# Altium schematic sheet Connectors.SchDoc: Gimbal - Connectors
size Letter; DrawnBy: Aidan Gratton; Organization: UW Robotics; Address1: 200 University Avenue; Address2: Waterloo; Address3: Ontario; Address4: Canada N2L 3G6; SheetNumber: 3; SheetTotal: 7
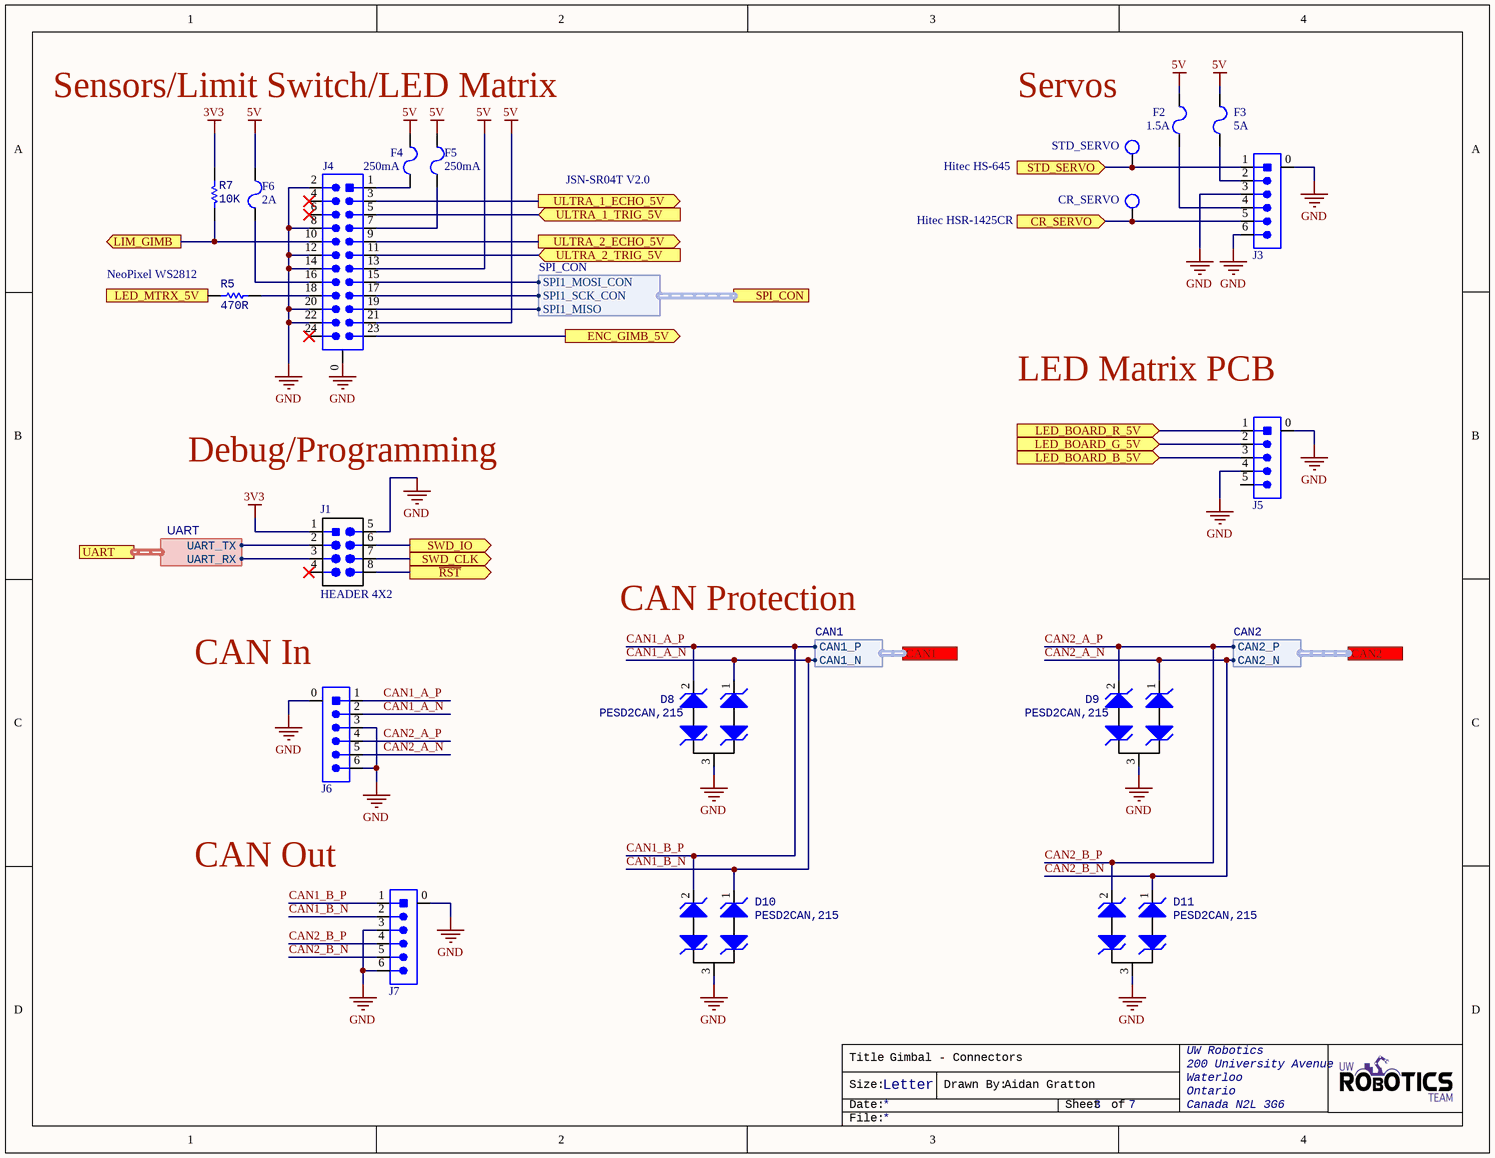
[diagram p0: Connectors.SchDoc]

## Parts
CR_SERVO  TESTPOINT_LOOP  [TESTPOINT_LOOP]  (value not drawn)
D8  Manufacturer Part Number: PESD2CAN,215  [TVS_DIODE_CAN]  (hidden comment: TVS_DIODE_CAN)
D9  Manufacturer Part Number: PESD2CAN,215  [TVS_DIODE_CAN]  (hidden comment: TVS_DIODE_CAN)
D10  Manufacturer Part Number: PESD2CAN,215  [TVS_DIODE_CAN]  (hidden comment: TVS_DIODE_CAN)
D11  Manufacturer Part Number: PESD2CAN,215  [TVS_DIODE_CAN]  (hidden comment: TVS_DIODE_CAN)
F2  Current Rating: 1.5A  [FUSE_1206]  (hidden comment: FUSE_1.5A_1206)
F3  Current Rating: 5A  [FUSE_1206]  (hidden comment: FUSE_5A_1206)
F4  Current Rating: 250mA  [FUSE_1206]  (hidden comment: FUSE_250mA_1206)
F5  Current Rating: 250mA  [FUSE_1206]  (hidden comment: FUSE_250mA_1206)
F6  Current Rating: 2A  [FUSE_1206]  (hidden comment: FUSE_2A_1206)
J1  HEADER 4X2  [HEADER_2X4]
J3  CON_6M_SM_RA  [MOLEX-5024940670]  (value not drawn)
J4  CON_12x2M_SM_RA  [MOLEX-5031482490]  (value not drawn)
J5  CON_5M_SM_RA  [MOLEX-5025850570]  (value not drawn)
J6  CON_6M_SM_RA  [MOLEX-5024940670]  (value not drawn)
J7  CON_6M_SM_RA  [MOLEX-5024940670]  (value not drawn)
R5  value 470R  [RESC0603(1608)_N]  (hidden comment: 470R 1%)
R7  value 10K  [RESC0603(1608)_N]  (hidden comment: RES_10K_0603)
STD_SERVO  TESTPOINT_LOOP  [TESTPOINT_LOOP]  (value not drawn)

## Ports
CAN1 (harness CAN1), CAN2 (harness CAN2), CR_SERVO (in), ENC_GIMB_5V (out), LED_BOARD_B_5V (in), LED_BOARD_G_5V (in), LED_BOARD_R_5V (in), LED_MTRX_5V (in), LIM_GIMB (out), SPI_CON (harness SPI_CON), STD_SERVO (in), SWD_CLK (out), SWD_IO (out), UART (harness UART), ULTRA_1_ECHO_5V (out), ULTRA_1_TRIG_5V (in), ULTRA_2_ECHO_5V (out), ULTRA_2_TRIG_5V (in), ~{RST} (out)

## Harnesses
UART: UART_RX, UART_TX
CAN2: CAN2_P, CAN2_N
CAN1: CAN1_P, CAN1_N
SPI_CON: SPI1_MISO, SPI1_MOSI_CON, SPI1_SCK_CON

## Nets
3V3: J1.1(VCC) R7.2
5V: F2.2 F3.2 F4.1 F5.2 F6.2 J4.13 J4.21
GND: D8.3 D9.3 D10.3 D11.3 J1.5(GND) J3.0 J3.3 J3.6 J4.0 J4.2 J4.8 J4.12 J4.14 J4.20 J4.22 J5.0 J5.4 J6.0 J6.3 J6.6 J7.0 J7.3 J7.6
~{RST}: J1.8 ; port ~{RST}
CAN1_A_N: D8.1 D10.1 J6.2 J7.2 ; port CAN1.CAN1_N  [also labelled CAN1_B_N]
CAN1_A_P: D8.2 D10.2 J6.1 J7.1 ; port CAN1.CAN1_P  [also labelled CAN1_B_P]
CAN2_A_N: D9.1 D11.1 J6.5 J7.5 ; port CAN2.CAN2_N  [also labelled CAN2_B_N]
CAN2_A_P: D9.2 D11.2 J6.4 J7.4 ; port CAN2.CAN2_P  [also labelled CAN2_B_P]
CR_SERVO: CR_SERVO.1 J3.5 ; port CR_SERVO
ENC_GIMB_5V: J4.23 ; port ENC_GIMB_5V
LED_BOARD_B_5V: J5.3 ; port LED_BOARD_B_5V
LED_BOARD_G_5V: J5.2 ; port LED_BOARD_G_5V
LED_BOARD_R_5V: J5.1 ; port LED_BOARD_R_5V
LED_MTRX_5V: R5.1 ; port LED_MTRX_5V
LIM_GIMB: J4.10 R7.1 ; port LIM_GIMB
STD_SERVO: J3.1 STD_SERVO.1 ; port STD_SERVO
SWD_CLK: J1.7 ; port SWD_CLK
SWD_IO: J1.6 ; port SWD_IO
ULTRA_1_ECHO_5V: J4.3 ; port ULTRA_1_ECHO_5V
ULTRA_1_TRIG_5V: J4.5 ; port ULTRA_1_TRIG_5V
ULTRA_2_ECHO_5V: J4.9 ; port ULTRA_2_ECHO_5V
ULTRA_2_TRIG_5V: J4.11 ; port ULTRA_2_TRIG_5V
NetF2_1: F2.1 J3.4
NetF3_1: F3.1 J3.2
NetF4_2: F4.2 J4.1
NetF5_1: F5.1 J4.7
NetF6_1: F6.1 J4.16
NetJ1_2: J1.2 ; port UART.UART_TX
NetJ1_3: J1.3 ; port UART.UART_RX
NetJ4_15: J4.15 ; port SPI_CON.SPI1_MOSI_CON
NetJ4_17: J4.17 ; port SPI_CON.SPI1_SCK_CON
NetJ4_18: J4.18 R5.2
NetJ4_19: J4.19 ; port SPI_CON.SPI1_MISO

Not connected (* = marked no-connect by the designer): J1 4*; J4 4* 6* 24*; J5 5

## Notes on the sheet
- Sensors/Limit Switch/LED Matrix
- Servos
- JSN-SR04T V2.0
- Hitec HSR-1425CR
- Hitec HS-645
- (near R5) NeoPixel WS2812
- (near J5) LED Matrix PCB
- Debug/Programming
- CAN Protection
- (near J6) CAN In
- CAN Out
- Title
- Size:
- Date:
- Letter
- Drawn By:
- Sheet
- of
- File:

## Library data of the parts
CR_SERVO STD_SERVO = TESTPOINT_LOOP: Loop testpoint through-hole pad; Manufacturer: Keystone Electronics; Manufacturer Part Number 1: 5002; Supplier Part Number 1: 36-5002-ND; Supplier 1: Digi-Key
D8-D11 = TVS_DIODE_CAN: TVS DIODE 24V 41V SOT323-3; Manufacturer: Nexperia USA Inc.; Package: SC-70, SOT-323; ComponentLink1Description: Datasheet; ComponentLink1URL: https://assets.nexperia.com/documents/data-sheet/PESD1CAN-U.pdf; Supplier Part Number 1: 1727-3891-1-ND; Supplier 1: Digi-Key
F2 = FUSE_1.5A_1206: FUSE SMD 1.5A 63V; Manufacturer 1: Littelfuse; Manufacturer Part Number 1: 046601.5NR; Fuse Type: Board Mount (Cartridge Style Excluded); DC Cold Resistance: 31mR; Power Dissipation: 157.5mW; Approvals: UL,CSA; Supplier 1: Digi-Key; Stock 1: 8989; Pricing 1: 1=0.84000, 5=0.81200, 10=0.78700, 50=0.66180, 100=0.54930, 250=0.49940, 500=0.42450, 1000=0.37455 (USD); RoHS: Yes; Mount: Surface Mount; Case/Package: 1206; Case Code (Imperial): 1206; Case Code (Metric): 3216; Housing Material: Ceramic; Min Operating Temperature: -55°C; Max Operating Temperature: 90°C; Package Quantity: 5000; Voltage Rating (AC): 63V; Voltage Rating (DC): 63V; Packaging: Tape and Reel; Current: 1.5A; Length: 3.18mm; Height: 0.023inch; Width: 0.06inch; Depth: 1.52mm; ComponentLink1URL: https://datasheet.ciiva.com/7444/littelfuse-fuse-466-7444359.pdf?src-supplier=Digi-Key; ComponentLink1Description: https://datasheet.ciiva.com/7444/littelfuse-fuse-466-7444359.pdf?src-supplier=Digi-Key; ComponentLink2URL: https://datasheet.ciiva.com/7444/littelfuse-fuse-466-7444363.pdf?src-supplier=Digi-Key; ComponentLink2Description: https://datasheet.ciiva.com/7444/littelfuse-fuse-466-7444363.pdf?src-supplier=Digi-Key; ComponentLink3URL: https://datasheet.ciiva.com/7444/littelfuse-fuse-466-7444350.pdf?src-supplier=Digi-Key; ComponentLink3Description: https://datasheet.ciiva.com/7444/littelfuse-fuse-466-7444350.pdf?src-supplier=Digi-Key; Supplier Part Number 1: F1462CT-ND
F3 = FUSE_5A_1206: FUSE SMD 5A 63V; Manufacturer 1: Littelfuse; Manufacturer Part Number 1: 0466005.NRHF; Voltage Rating (AC): 32V; Fuse Type: Board Mount (Cartridge Style Excluded); DC Cold Resistance: 31mR; Power Dissipation: 157.5mW; Approvals: UL,CSA; Supplier 1: Digi-Key; Stock 1: 8989; Pricing 1: 1=0.84000, 5=0.81200, 10=0.78700, 50=0.66180, 100=0.54930, 250=0.49940, 500=0.42450, 1000=0.37455 (USD); RoHS: Yes; Mount: Surface Mount; Case/Package: 1206; Case Code (Imperial): 1206; Case Code (Metric): 3216; Housing Material: Ceramic; Min Operating Temperature: -55°C; Max Operating Temperature: 90°C; Package Quantity: 5000; Voltage Rating (DC): 32V; Packaging: Tape and Reel; Current: 5A; Length: 3.18mm; Height: 0.023inch; Width: 0.06inch; Depth: 1.52mm; ComponentLink1URL: https://datasheet.ciiva.com/7444/littelfuse-fuse-466-7444359.pdf?src-supplier=Digi-Key; ComponentLink1Description: https://datasheet.ciiva.com/7444/littelfuse-fuse-466-7444359.pdf?src-supplier=Digi-Key; ComponentLink2URL: https://datasheet.ciiva.com/7444/littelfuse-fuse-466-7444363.pdf?src-supplier=Digi-Key; ComponentLink2Description: https://datasheet.ciiva.com/7444/littelfuse-fuse-466-7444363.pdf?src-supplier=Digi-Key; ComponentLink3URL: https://datasheet.ciiva.com/7444/littelfuse-fuse-466-7444350.pdf?src-supplier=Digi-Key; ComponentLink3Description: https://datasheet.ciiva.com/7444/littelfuse-fuse-466-7444350.pdf?src-supplier=Digi-Key; Supplier Part Number 1: F6019CT-ND
F4 F5 = FUSE_250mA_1206: FUSE SMD 250mA 125V; Manufacturer 1: Littelfuse; Manufacturer Part Number 1: 0466.250NR; Fuse Type: Board Mount (Cartridge Style Excluded); DC Cold Resistance: 31mR; Power Dissipation: 157.5mW; Approvals: UL,CSA; Supplier 1: Digi-Key; Stock 1: 8989; Pricing 1: 1=0.84000, 5=0.81200, 10=0.78700, 50=0.66180, 100=0.54930, 250=0.49940, 500=0.42450, 1000=0.37455 (USD); RoHS: Yes; Mount: Surface Mount; Case/Package: 1206; Case Code (Imperial): 1206; Case Code (Metric): 3216; Housing Material: Ceramic; Min Operating Temperature: -55°C; Max Operating Temperature: 90°C; Package Quantity: 5000; Voltage Rating (AC): 125V; Voltage Rating (DC): 125V; Packaging: Tape and Reel; Current: 250mA; Length: 3.18mm; Height: 0.023inch; Width: 0.06inch; Depth: 1.52mm; ComponentLink1URL: https://datasheet.ciiva.com/7444/littelfuse-fuse-466-7444359.pdf?src-supplier=Digi-Key; ComponentLink1Description: https://datasheet.ciiva.com/7444/littelfuse-fuse-466-7444359.pdf?src-supplier=Digi-Key; ComponentLink2URL: https://datasheet.ciiva.com/7444/littelfuse-fuse-466-7444363.pdf?src-supplier=Digi-Key; ComponentLink2Description: https://datasheet.ciiva.com/7444/littelfuse-fuse-466-7444363.pdf?src-supplier=Digi-Key; ComponentLink3URL: https://datasheet.ciiva.com/7444/littelfuse-fuse-466-7444350.pdf?src-supplier=Digi-Key; ComponentLink3Description: https://datasheet.ciiva.com/7444/littelfuse-fuse-466-7444350.pdf?src-supplier=Digi-Key; Supplier Part Number 1: F1452CT-ND
F6 = FUSE_2A_1206: FUSE SMD 2A 63V; Manufacturer 1: Littelfuse; Manufacturer Part Number 1: 0466002.NRHF; Fuse Type: Board Mount (Cartridge Style Excluded); DC Cold Resistance: 31mR; Power Dissipation: 157.5mW; Approvals: UL,CSA; Supplier 1: Digi-Key; Stock 1: 8989; Pricing 1: 1=0.84000, 5=0.81200, 10=0.78700, 50=0.66180, 100=0.54930, 250=0.49940, 500=0.42450, 1000=0.37455 (USD); RoHS: Yes; Mount: Surface Mount; Case/Package: 1206; Case Code (Imperial): 1206; Case Code (Metric): 3216; Housing Material: Ceramic; Min Operating Temperature: -55°C; Max Operating Temperature: 90°C; Package Quantity: 5000; Voltage Rating (AC): 63V; Voltage Rating (DC): 63V; Packaging: Tape and Reel; Current: 2A; Length: 3.18mm; Height: 0.023inch; Width: 0.06inch; Depth: 1.52mm; ComponentLink1URL: https://datasheet.ciiva.com/7444/littelfuse-fuse-466-7444359.pdf?src-supplier=Digi-Key; ComponentLink1Description: https://datasheet.ciiva.com/7444/littelfuse-fuse-466-7444359.pdf?src-supplier=Digi-Key; ComponentLink2URL: https://datasheet.ciiva.com/7444/littelfuse-fuse-466-7444363.pdf?src-supplier=Digi-Key; ComponentLink2Description: https://datasheet.ciiva.com/7444/littelfuse-fuse-466-7444363.pdf?src-supplier=Digi-Key; ComponentLink3URL: https://datasheet.ciiva.com/7444/littelfuse-fuse-466-7444350.pdf?src-supplier=Digi-Key; ComponentLink3Description: https://datasheet.ciiva.com/7444/littelfuse-fuse-466-7444350.pdf?src-supplier=Digi-Key; Supplier Part Number 1: F5696CT-ND
J1 = HEADER 4X2: CONN HEADER VERT 8POS 2.54MM; Manufacturer Part Number 1: M20-9980445; Manufacturer 1: Harwin Inc.; Supplier Part Number 1: 952-2122-ND; Supplier 1: Digi-Key; Mount: Through Hole
J3 J6 J7 = CON_6M_SM_RA: CONN HEADER SMD RIGHT ANGLE 2MM PITCH; Manufacturer 1: Molex; Manufacturer Part Number 1: 502494-0670; Insulation Resistance: 1GR; Current Rating: 3A; Voltage Rating: 250V; Connector Type: Receptacle,Forked; Number of Positions: 6; Gender: Receptacle; Glow Wire Compliant: Non-compliant; Supplier 1: Digi-Key; Stock 1: 7093; Pricing 1: 1=0.81000, 10=0.70800, 25=0.66680, 50=0.63880, 100=0.61110, 250=0.55552 (USD); RoHS: Yes; Mount: Surface Mount; Material: Polybutylene; Color: Natural; Housing Material: PBT; Housing Color: Natural; Contact Plating: Tin; Contact Material: Copper Alloy; Min Operating Temperature: -25°C; Max Operating Temperature: 85°C; Package Quantity: 950; Number of Rows: 1; Fastening Type: Latch; Packaging: Tape and Reel; Termination: Solder; Number of Contacts: 6; Orientation: Right Angle; Number of Circuits: 6; Contact Gender: Female; Max Voltage Rating (AC): 250V; Max Voltage Rating (DC): 250V; Length: 16mm; Pitch: 2mm; Depth: 6.85mm; Radiation Hardening: No; REACH SVHC: Unknown; Flammability Rating: UL94 V-0; ComponentLink1URL: https://datasheet.ciiva.com/755/5024940670-sd-755844.pdf?src-supplier=Digi-Key; ComponentLink1Description: https://datasheet.ciiva.com/755/5024940670-sd-755844.pdf?src-supplier=Digi-Key; ComponentLink2URL: https://datasheet.ciiva.com/24467/101355024940670-pcb-receptacles-24467588.pdf?src-supplier=Onlinecomponents.com; ComponentLink2Description: https://datasheet.ciiva.com/24467/101355024940670-pcb-receptacles-24467588.pdf?src-supplier=Onlinecomponents.com; ComponentLink3URL: https://datasheet.ciiva.com/16656/5024940670-pcb-receptacles-16656439.pdf?src-supplier=Avnet+Europe; ComponentLink3Description: https://datasheet.ciiva.com/16656/5024940670-pcb-receptacles-16656439.pdf?src-supplier=Avnet+Europe; ComponentLink4URL: https://datasheet.ciiva.com/7436/1630854-7436283.pdf?src-supplier=Newark; ComponentLink4Description: https://datasheet.ciiva.com/7436/1630854-7436283.pdf?src-supplier=Newark; ComponentLink5URL: https://datasheet.ciiva.com/5157/5024940670-pcb-receptacles-179322-5157180.pdf?src-supplier=Mouser; ComponentLink5Description: https://datasheet.ciiva.com/5157/5024940670-pcb-receptacles-179322-5157180.pdf?src-supplier=Mouser; ComponentLink6URL: https://datasheet.ciiva.com/7917/1630854-7917014.pdf?src-supplier=Element14; ComponentLink6Description: https://datasheet.ciiva.com/7917/1630854-7917014.pdf?src-supplier=Element14; ComponentLink7URL: https://datasheet.ciiva.com/30242/101355024940670-pcb-receptacles-30242550.pdf?src-supplier=Onlinecomponents.com; ComponentLink7Description: https://datasheet.ciiva.com/30242/101355024940670-pcb-receptacles-30242550.pdf?src-supplier=Onlinecomponents.com; ComponentLink8URL: https://datasheet.ciiva.com/755/5024940670-sd-755789.pdf?src-supplier=Digi-Key; ComponentLink8Description: https://datasheet.ciiva.com/755/5024940670-sd-755789.pdf?src-supplier=Digi-Key; Supplier Part Number 1: WM2283CT-ND
J4 = CON_12x2M_SM_RA: CONN HEADER SMD RIGHT ANGLE 1.5MM PITCH
J5 = CON_5M_SM_RA: CONN HEADER SMD RIGHT ANGLE 1.5MM PITCH; Manufacturer 1: Molex; Manufacturer Part Number 1: 5025850570; Connector Type: Receptacle,Center Strip Contact; Number of Positions: 5; Current Rating: 2A; Supplier 1: Digi-Key; Stock 1: 2875; RoHS: Yes; Mount: Surface Mount; Termination: Solder; Number of Contacts: 5; Orientation: Right Angle; Number of Circuits: 5; Number of Rows: 1; Supplier Part Number 1: WM14469CT-ND
R5 = RES_470R_0603: RES SMD 470 OHM 1% 1/10W 0603; Manufacturer: Yageo; MPN: AC0603FR-07470RL; Package: 0603 (1608 Metric); Dimensions: 0.063" L x 0.031" W (1.60mm x 0.80mm); Tolerance: 1%; Supplier Part Number 1: 311-470LDCT-ND; Supplier 1: Digi-Key
R7 = RES_10K_0603: RES SMD 10K OHM 5% 1/10W 0603; Manufacturer: Yageo; MPN: RC0603JR-0710KL; Package: 0603 (1608 Metric); Dimensions: 0.063" L x 0.031" W (1.60mm x 0.80mm); Tolerance: 5%; Supplier Part Number 1: 311-10KGRCT-ND; Supplier 1: Digi-Key